# Altium schematic sheet PWR_TPS8268180.SchDoc
size A3
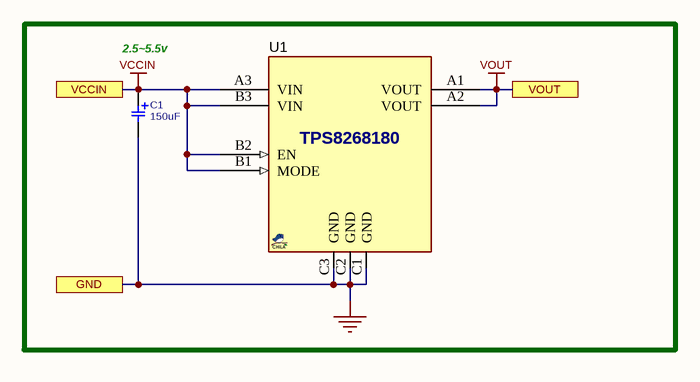
[diagram p0: PWR_TPS8268180.SchDoc]

## Parts
C1  150uF  [C_TN_3528]
U1  TPS8268180  [PSON65_8T_3X3]  (value not drawn)

## Blocks framed on the sheet
2.5~5.5v: C1 U1

## Ports
GND, VCCIN, VOUT

## Nets
GND: C1.2 U1.C1(GND) U1.C2(GND) U1.C3(GND) ; port GND
VCCIN: C1.1 U1.A3(VIN) U1.B1(MODE) U1.B2(EN) U1.B3(VIN) ; port VCCIN
VOUT: U1.A1(VOUT) U1.A2(VOUT) ; port VOUT

## Library data of the parts
C1 = CAP_SMD_TAN_3528: CAP, SMD, TAN,; PARAM: 25 mOhms; MANF: KEMET; MANF_P#: T520B157M006ATE025; PARAM2: 6.3V; PRICE: 1$; VALUE: 150uF
U1 = VREG_TPS8268180_BGA9: DC2DC Switching MODULE, Buck, 1.6A, Fixed, 2.5MHz, integrated Inductor; PARAM2: 2.5~5.5Vin, Fixed; MANF: Texas Instruments; MANF_P#: TPS8268180SIP; PARAM: 1.6A, 5.5MHz, -40~85oC; PRICE: 1.5$; Value: TPS8268180